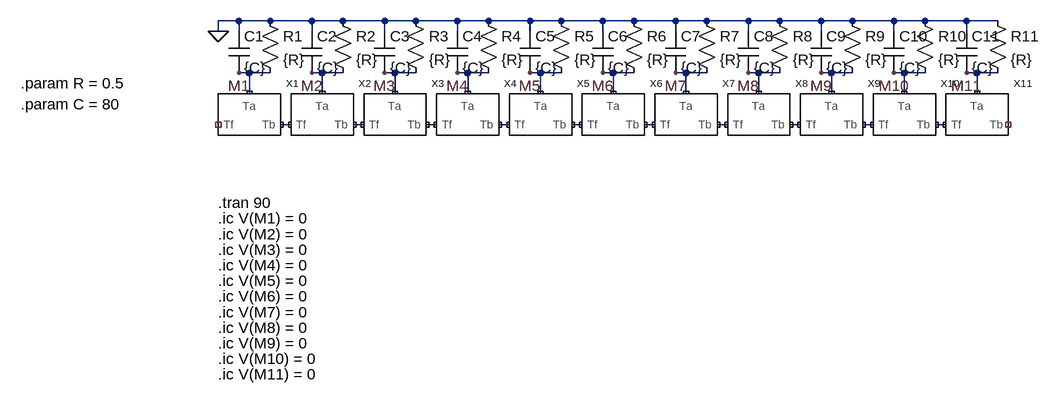
[diagram p0: schematic 22 Cell Stack.asc]
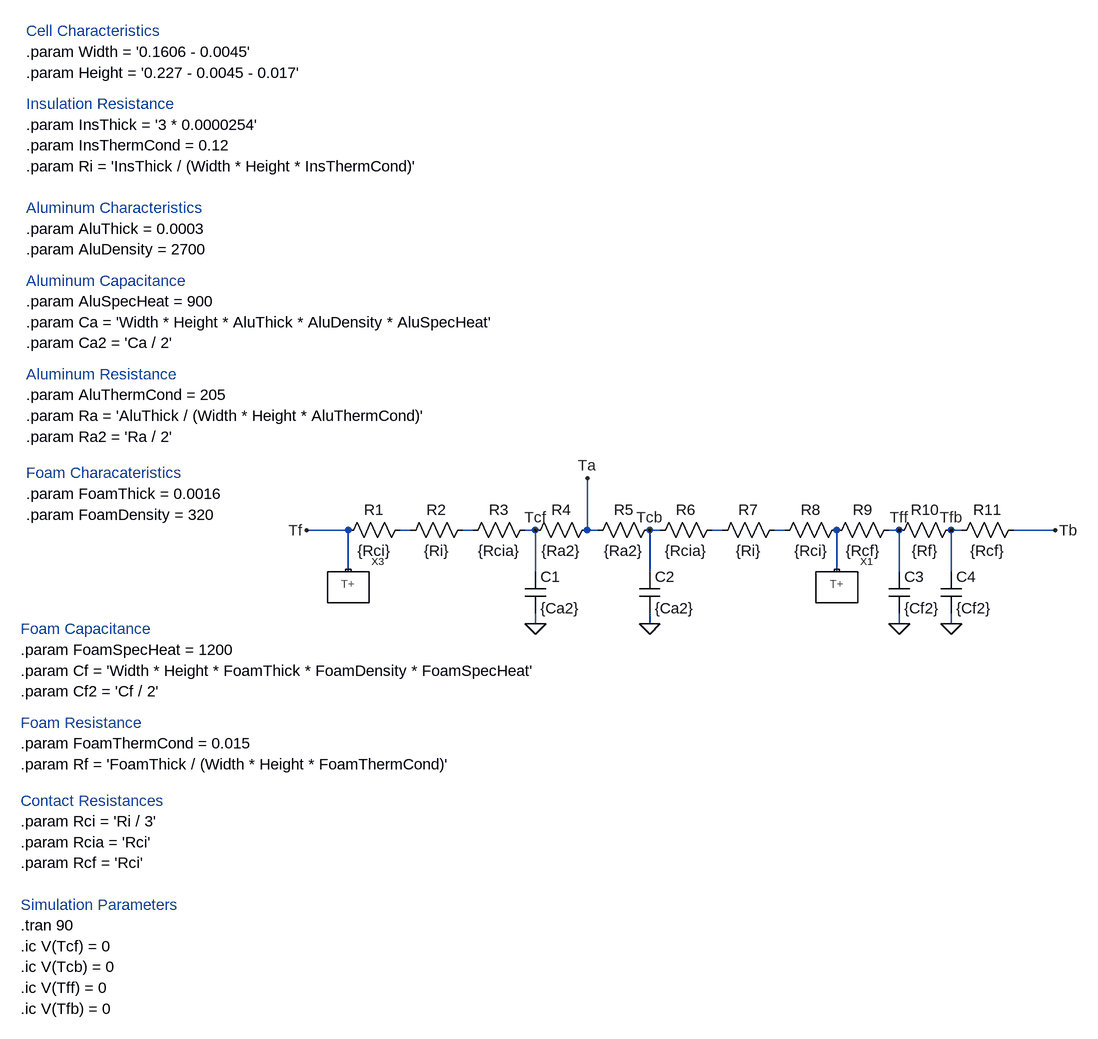
[diagram p1: sub-circuit module.asc]
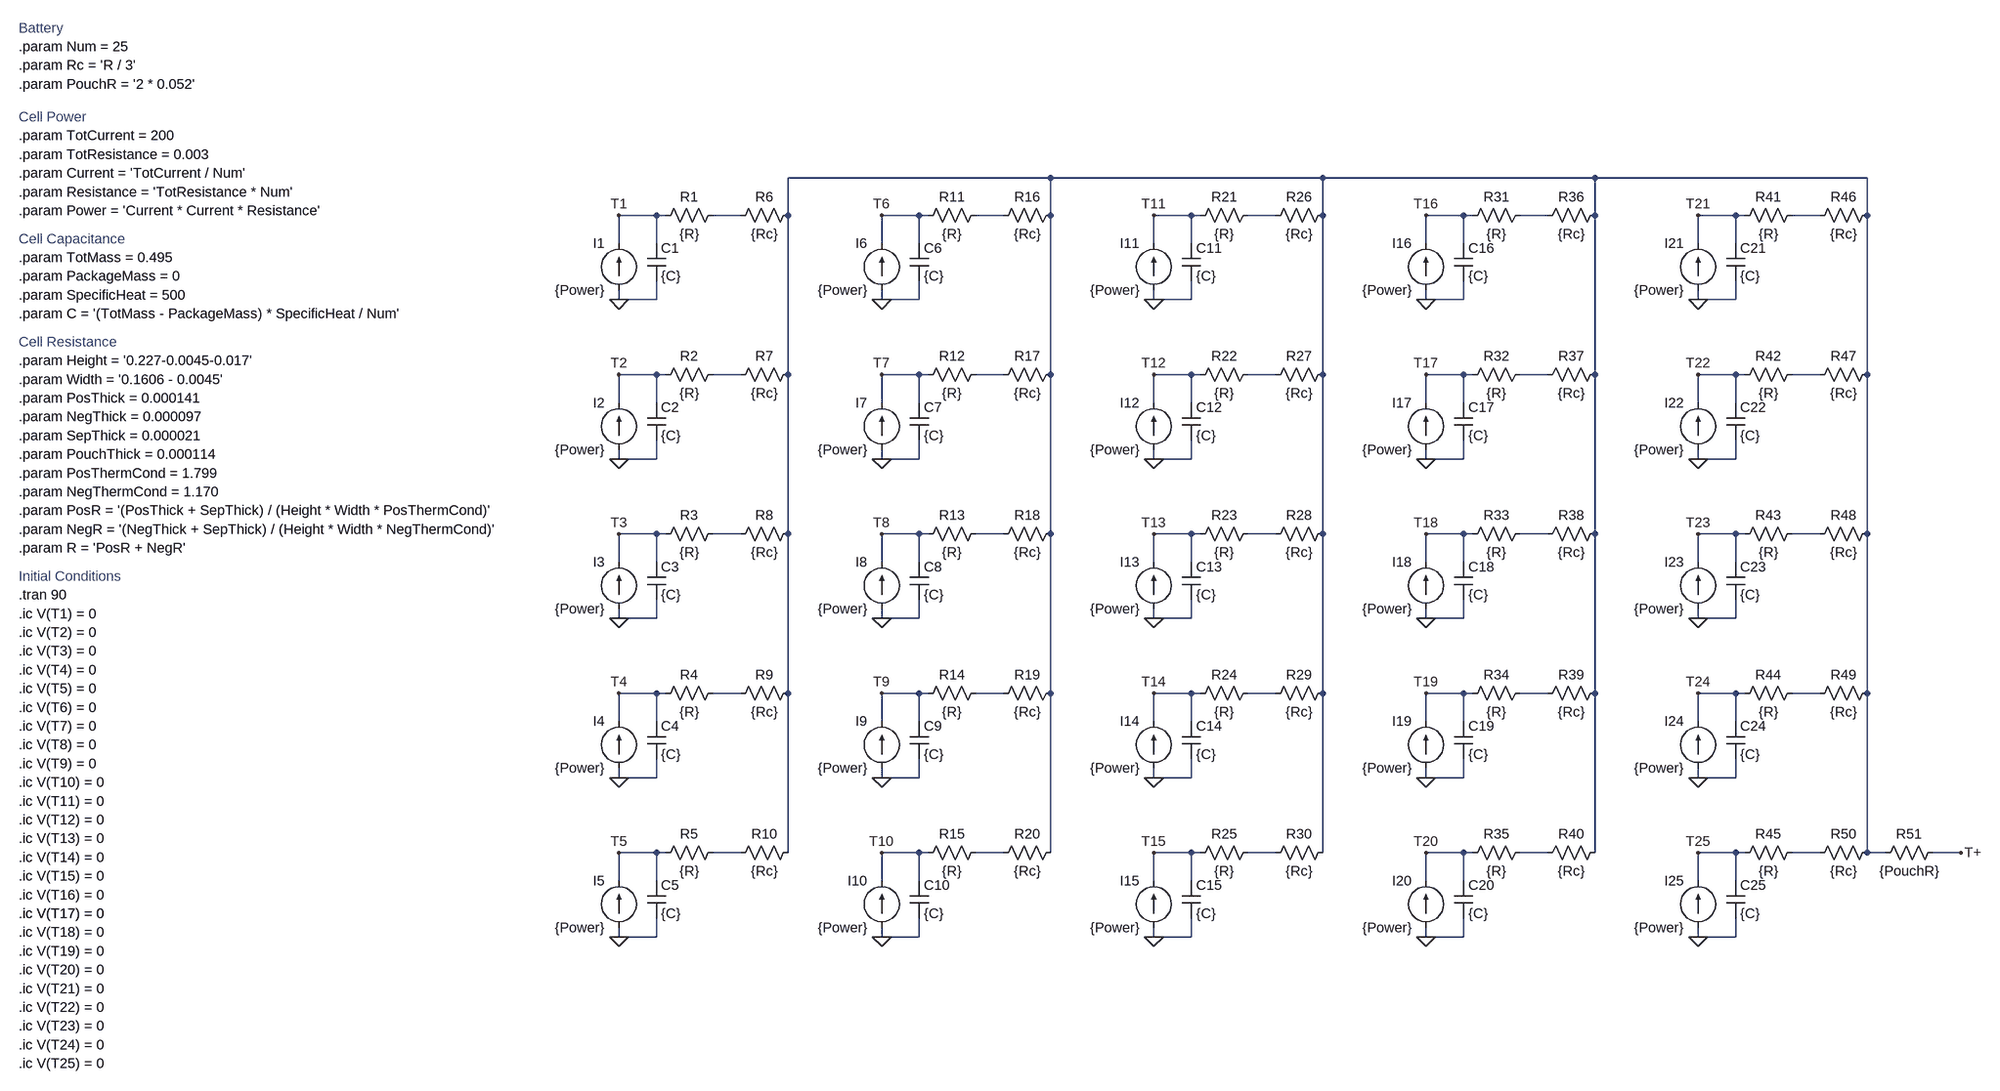
[diagram p2: sub-circuit cell.asc]
22 Cell Stack.asc, the LTspice schematic file:
Version 4
SHEET 1 880 680
WIRE -560 0 -592 0
WIRE -512 0 -560 0
WIRE -448 0 -512 0
WIRE -400 0 -448 0
WIRE -336 0 -400 0
WIRE -288 0 -336 0
WIRE -224 0 -288 0
WIRE -176 0 -224 0
WIRE -112 0 -176 0
WIRE -64 0 -112 0
WIRE 0 0 -64 0
WIRE 48 0 0 0
WIRE 112 0 48 0
WIRE 160 0 112 0
WIRE 224 0 160 0
WIRE 272 0 224 0
WIRE 336 0 272 0
WIRE 384 0 336 0
WIRE 448 0 384 0
WIRE 496 0 448 0
WIRE 560 0 496 0
WIRE 608 0 560 0
WIRE -592 16 -592 0
WIRE -560 16 -560 0
WIRE -448 16 -448 0
WIRE -336 16 -336 0
WIRE -224 16 -224 0
WIRE -112 16 -112 0
WIRE 0 16 0 0
WIRE 112 16 112 0
WIRE 224 16 224 0
WIRE 336 16 336 0
WIRE 448 16 448 0
WIRE 560 16 560 0
WIRE -544 80 -560 80
WIRE -512 80 -544 80
WIRE -432 80 -448 80
WIRE -400 80 -432 80
WIRE -320 80 -336 80
WIRE -288 80 -320 80
WIRE -208 80 -224 80
WIRE -176 80 -208 80
WIRE -96 80 -112 80
WIRE -64 80 -96 80
WIRE 16 80 0 80
WIRE 48 80 16 80
WIRE 128 80 112 80
WIRE 160 80 128 80
WIRE 240 80 224 80
WIRE 272 80 240 80
WIRE 352 80 336 80
WIRE 384 80 352 80
WIRE 464 80 448 80
WIRE 496 80 464 80
WIRE 576 80 560 80
WIRE 608 80 576 80
WIRE -544 112 -544 80
WIRE -432 112 -432 80
WIRE -320 112 -320 80
WIRE -208 112 -208 80
WIRE -96 112 -96 80
WIRE 16 112 16 80
WIRE 128 112 128 80
WIRE 240 112 240 80
WIRE 352 112 352 80
WIRE 464 112 464 80
WIRE 576 112 576 80
WIRE -480 160 -496 160
WIRE -368 160 -384 160
WIRE -256 160 -272 160
WIRE -144 160 -160 160
WIRE -32 160 -48 160
WIRE 80 160 64 160
WIRE 192 160 176 160
WIRE 304 160 288 160
WIRE 416 160 400 160
WIRE 528 160 512 160
FLAG -592 16 0
FLAG -560 80 M1
FLAG -448 80 M2
FLAG -336 80 M3
FLAG -224 80 M4
FLAG -112 80 M5
FLAG 0 80 M6
FLAG 112 80 M7
FLAG 224 80 M8
FLAG 336 80 M9
FLAG 448 80 M10
FLAG 560 80 M11
SYMBOL res -528 -16 R0
SYMATTR InstName R1
SYMATTR Value {R}
SYMBOL Module -544 160 R0
SYMATTR InstName X1
SYMBOL Module -432 160 R0
SYMATTR InstName X2
SYMBOL Module -320 160 R0
SYMATTR InstName X3
SYMBOL Module -208 160 R0
SYMATTR InstName X4
SYMBOL Module -96 160 R0
SYMATTR InstName X5
SYMBOL Module 16 160 R0
SYMATTR InstName X6
SYMBOL Module 128 160 R0
SYMATTR InstName X7
SYMBOL Module 240 160 R0
SYMATTR InstName X8
SYMBOL Module 352 160 R0
SYMATTR InstName X9
SYMBOL Module 464 160 R0
SYMATTR InstName X10
SYMBOL Module 576 160 R0
SYMATTR InstName X11
SYMBOL res -416 -16 R0
SYMATTR InstName R2
SYMATTR Value {R}
SYMBOL res -304 -16 R0
SYMATTR InstName R3
SYMATTR Value {R}
SYMBOL res -192 -16 R0
SYMATTR InstName R4
SYMATTR Value {R}
SYMBOL res -80 -16 R0
SYMATTR InstName R5
SYMATTR Value {R}
SYMBOL res 32 -16 R0
SYMATTR InstName R6
SYMATTR Value {R}
SYMBOL res 144 -16 R0
SYMATTR InstName R7
SYMATTR Value {R}
SYMBOL res 256 -16 R0
SYMATTR InstName R8
SYMATTR Value {R}
SYMBOL res 368 -16 R0
SYMATTR InstName R9
SYMATTR Value {R}
SYMBOL res 480 -16 R0
SYMATTR InstName R10
SYMATTR Value {R}
SYMBOL res 592 -16 R0
SYMATTR InstName R11
SYMATTR Value {R}
SYMBOL cap 544 16 R0
SYMATTR InstName C11
SYMATTR Value {C}
SYMBOL cap 432 16 R0
SYMATTR InstName C10
SYMATTR Value {C}
SYMBOL cap 320 16 R0
SYMATTR InstName C9
SYMATTR Value {C}
SYMBOL cap -576 16 R0
SYMATTR InstName C1
SYMATTR Value {C}
SYMBOL cap -464 16 R0
SYMATTR InstName C2
SYMATTR Value {C}
SYMBOL cap -352 16 R0
SYMATTR InstName C3
SYMATTR Value {C}
SYMBOL cap -240 16 R0
SYMATTR InstName C4
SYMATTR Value {C}
SYMBOL cap -128 16 R0
SYMATTR InstName C5
SYMATTR Value {C}
SYMBOL cap -16 16 R0
SYMATTR InstName C6
SYMATTR Value {C}
SYMBOL cap 96 16 R0
SYMATTR InstName C7
SYMATTR Value {C}
SYMBOL cap 208 16 R0
SYMATTR InstName C8
SYMATTR Value {C}
TEXT -592 280 Left 2 !.tran 90
TEXT -896 96 Left 2 !.param R = 0.5
TEXT -896 128 Left 2 !.param C = 80
TEXT -592 304 Left 2 !.ic V(M1) = 0
TEXT -592 328 Left 2 !.ic V(M2) = 0
TEXT -592 352 Left 2 !.ic V(M3) = 0
TEXT -592 376 Left 2 !.ic V(M4) = 0
TEXT -592 400 Left 2 !.ic V(M5) = 0
TEXT -592 424 Left 2 !.ic V(M6) = 0
TEXT -592 448 Left 2 !.ic V(M7) = 0
TEXT -592 472 Left 2 !.ic V(M8) = 0
TEXT -592 496 Left 2 !.ic V(M9) = 0
TEXT -592 520 Left 2 !.ic V(M10) = 0
TEXT -592 544 Left 2 !.ic V(M11) = 0

module.asc, the sub-circuit schematic file:
Version 4
SHEET 1 1396 928
WIRE 208 48 144 48
WIRE 304 48 288 48
WIRE 400 48 384 48
WIRE 496 48 480 48
WIRE 576 48 576 -32
WIRE 592 48 576 48
WIRE 688 48 672 48
WIRE 784 48 768 48
WIRE 880 48 864 48
WIRE 1056 48 1040 48
WIRE 1152 48 1136 48
WIRE 1296 48 1232 48
WIRE 208 112 208 48
WIRE 496 112 496 48
WIRE 672 112 672 48
WIRE 960 112 960 48
WIRE 1056 112 1056 48
WIRE 1136 112 1136 48
WIRE 496 192 496 176
WIRE 672 192 672 176
WIRE 1056 192 1056 176
WIRE 1136 192 1136 176
FLAG 496 192 0
FLAG 1056 192 0
FLAG 144 48 Tf
FLAG 1296 48 Tb
FLAG 576 -32 Ta
FLAG 672 192 0
FLAG 1136 192 0
FLAG 496 48 Tcf
FLAG 672 48 Tcb
FLAG 1056 48 Tff
FLAG 1136 48 Tfb
SYMBOL Cell 960 160 R0
SYMATTR InstName X1
SYMBOL Cell 208 160 R0
SYMATTR InstName X3
SYMBOL res 1152 32 R90
WINDOW 0 0 56 VBottom 2
WINDOW 3 32 56 VTop 2
SYMATTR InstName R10
SYMATTR Value {Rf}
SYMBOL res 400 32 R90
WINDOW 0 0 56 VBottom 2
WINDOW 3 32 56 VTop 2
SYMATTR InstName R2
SYMATTR Value {Ri}
SYMBOL res 592 32 R90
WINDOW 0 0 56 VBottom 2
WINDOW 3 32 56 VTop 2
SYMATTR InstName R4
SYMATTR Value {Ra2}
SYMBOL res 880 32 R90
WINDOW 0 0 56 VBottom 2
WINDOW 3 32 56 VTop 2
SYMATTR InstName R7
SYMATTR Value {Ri}
SYMBOL res 304 32 R90
WINDOW 0 0 56 VBottom 2
WINDOW 3 32 56 VTop 2
SYMATTR InstName R1
SYMATTR Value {Rci}
SYMBOL res 976 32 R90
WINDOW 0 0 56 VBottom 2
WINDOW 3 32 56 VTop 2
SYMATTR InstName R8
SYMATTR Value {Rci}
SYMBOL res 496 32 R90
WINDOW 0 0 56 VBottom 2
WINDOW 3 32 56 VTop 2
SYMATTR InstName R3
SYMATTR Value {Rcia}
SYMBOL res 784 32 R90
WINDOW 0 0 56 VBottom 2
WINDOW 3 32 56 VTop 2
SYMATTR InstName R6
SYMATTR Value {Rcia}
SYMBOL res 1056 32 R90
WINDOW 0 0 56 VBottom 2
WINDOW 3 32 56 VTop 2
SYMATTR InstName R9
SYMATTR Value {Rcf}
SYMBOL res 1248 32 R90
WINDOW 0 0 56 VBottom 2
WINDOW 3 32 56 VTop 2
SYMATTR InstName R11
SYMATTR Value {Rcf}
SYMBOL cap 480 112 R0
SYMATTR InstName C1
SYMATTR Value {Ca2}
SYMBOL cap 1040 112 R0
SYMATTR InstName C3
SYMATTR Value {Cf2}
SYMBOL cap 656 112 R0
SYMATTR InstName C2
SYMATTR Value {Ca2}
SYMBOL res 688 32 R90
WINDOW 0 0 56 VBottom 2
WINDOW 3 32 56 VTop 2
SYMATTR InstName R5
SYMATTR Value {Ra2}
SYMBOL cap 1120 112 R0
SYMATTR InstName C4
SYMATTR Value {Cf2}
TEXT -296 656 Left 2 !.tran 90
TEXT -288 -720 Left 2 ;Cell Characteristics
TEXT -288 -688 Left 2 !.param Width = '0.1606 - 0.0045'
TEXT -288 -656 Left 2 !.param Height = '0.227 - 0.0045 - 0.017'
TEXT -288 -608 Left 2 ;Insulation Resistance
TEXT -288 -576 Left 2 !.param InsThick = '3 * 0.0000254'
TEXT -288 -544 Left 2 !.param InsThermCond = 0.12
TEXT -296 496 Left 2 !.param Rci = 'Ri / 3'
TEXT -288 -448 Left 2 ;Aluminum Characteristics
TEXT -288 -416 Left 2 !.param AluThick = 0.0003
TEXT -288 -384 Left 2 !.param AluDensity = 2700
TEXT -288 -336 Left 2 ;Aluminum Capacitance
TEXT -288 -304 Left 2 !.param AluSpecHeat = 900
TEXT -288 -272 Left 2 !.param Ca = 'Width * Height * AluThick * AluDensity * AluSpecHeat'
TEXT -288 -240 Left 2 !.param Ca2 = 'Ca / 2'
TEXT -288 -192 Left 2 ;Aluminum Resistance
TEXT -288 -160 Left 2 !.param AluThermCond = 205
TEXT -288 -128 Left 2 !.param Ra = 'AluThick / (Width * Height * AluThermCond)'
TEXT -288 -96 Left 2 !.param Ra2 = 'Ra / 2'
TEXT -296 528 Left 2 !.param Rcia = 'Rci'
TEXT -288 -40 Left 2 ;Foam Characateristics
TEXT -288 -8 Left 2 !.param FoamThick = 0.0016
TEXT -288 24 Left 2 !.param FoamDensity = 320
TEXT -296 200 Left 2 ;Foam Capacitance
TEXT -296 232 Left 2 !.param FoamSpecHeat = 1200
TEXT -296 264 Left 2 !.param Cf = 'Width * Height * FoamThick * FoamDensity * FoamSpecHeat'
TEXT -296 296 Left 2 !.param Cf2 = 'Cf / 2'
TEXT -296 344 Left 2 ;Foam Resistance
TEXT -296 376 Left 2 !.param FoamThermCond = 0.015
TEXT -296 408 Left 2 !.param Rf = 'FoamThick / (Width * Height * FoamThermCond)'
TEXT -296 560 Left 2 !.param Rcf = 'Rci'
TEXT -288 -512 Left 2 !.param Ri = 'InsThick / (Width * Height * InsThermCond)'
TEXT -296 688 Left 2 !.ic V(Tcf) = 0
TEXT -296 720 Left 2 !.ic V(Tcb) = 0
TEXT -296 752 Left 2 !.ic V(Tff) = 0
TEXT -296 784 Left 2 !.ic V(Tfb) = 0
TEXT -296 624 Left 2 ;Simulation Parameters
TEXT -296 464 Left 2 ;Contact Resistances

cell.asc, the sub-circuit schematic file:
Version 4
SHEET 1 880 680
WIRE -6528 -8784 -6976 -8784
WIRE -6064 -8784 -6528 -8784
WIRE -5600 -8784 -6064 -8784
WIRE -5136 -8784 -5600 -8784
WIRE -7200 -8720 -7264 -8720
WIRE -7184 -8720 -7200 -8720
WIRE -7056 -8720 -7104 -8720
WIRE -6976 -8720 -6976 -8784
WIRE -6752 -8720 -6816 -8720
WIRE -6736 -8720 -6752 -8720
WIRE -6608 -8720 -6656 -8720
WIRE -6528 -8720 -6528 -8784
WIRE -6288 -8720 -6352 -8720
WIRE -6272 -8720 -6288 -8720
WIRE -6144 -8720 -6192 -8720
WIRE -6064 -8720 -6064 -8784
WIRE -5824 -8720 -5888 -8720
WIRE -5808 -8720 -5824 -8720
WIRE -5680 -8720 -5728 -8720
WIRE -5600 -8720 -5600 -8784
WIRE -5360 -8720 -5424 -8720
WIRE -5344 -8720 -5360 -8720
WIRE -5216 -8720 -5264 -8720
WIRE -5136 -8720 -5136 -8784
WIRE -7264 -8672 -7264 -8720
WIRE -7200 -8672 -7200 -8720
WIRE -6816 -8672 -6816 -8720
WIRE -6752 -8672 -6752 -8720
WIRE -6352 -8672 -6352 -8720
WIRE -6288 -8672 -6288 -8720
WIRE -5888 -8672 -5888 -8720
WIRE -5824 -8672 -5824 -8720
WIRE -5424 -8672 -5424 -8720
WIRE -5360 -8672 -5360 -8720
WIRE -7264 -8576 -7264 -8592
WIRE -7200 -8576 -7200 -8608
WIRE -7200 -8576 -7264 -8576
WIRE -6816 -8576 -6816 -8592
WIRE -6752 -8576 -6752 -8608
WIRE -6752 -8576 -6816 -8576
WIRE -6352 -8576 -6352 -8592
WIRE -6288 -8576 -6288 -8608
WIRE -6288 -8576 -6352 -8576
WIRE -5888 -8576 -5888 -8592
WIRE -5824 -8576 -5824 -8608
WIRE -5824 -8576 -5888 -8576
WIRE -5424 -8576 -5424 -8592
WIRE -5360 -8576 -5360 -8608
WIRE -5360 -8576 -5424 -8576
WIRE -7200 -8448 -7264 -8448
WIRE -7184 -8448 -7200 -8448
WIRE -7056 -8448 -7104 -8448
WIRE -6976 -8448 -6976 -8720
WIRE -6752 -8448 -6816 -8448
WIRE -6736 -8448 -6752 -8448
WIRE -6608 -8448 -6656 -8448
WIRE -6528 -8448 -6528 -8720
WIRE -6288 -8448 -6352 -8448
WIRE -6272 -8448 -6288 -8448
WIRE -6144 -8448 -6192 -8448
WIRE -6064 -8448 -6064 -8720
WIRE -5824 -8448 -5888 -8448
WIRE -5808 -8448 -5824 -8448
WIRE -5680 -8448 -5728 -8448
WIRE -5600 -8448 -5600 -8720
WIRE -5360 -8448 -5424 -8448
WIRE -5344 -8448 -5360 -8448
WIRE -5216 -8448 -5264 -8448
WIRE -5136 -8448 -5136 -8720
WIRE -7264 -8400 -7264 -8448
WIRE -7200 -8400 -7200 -8448
WIRE -6816 -8400 -6816 -8448
WIRE -6752 -8400 -6752 -8448
WIRE -6352 -8400 -6352 -8448
WIRE -6288 -8400 -6288 -8448
WIRE -5888 -8400 -5888 -8448
WIRE -5824 -8400 -5824 -8448
WIRE -5424 -8400 -5424 -8448
WIRE -5360 -8400 -5360 -8448
WIRE -7264 -8304 -7264 -8320
WIRE -7200 -8304 -7200 -8336
WIRE -7200 -8304 -7264 -8304
WIRE -6816 -8304 -6816 -8320
WIRE -6752 -8304 -6752 -8336
WIRE -6752 -8304 -6816 -8304
WIRE -6352 -8304 -6352 -8320
WIRE -6288 -8304 -6288 -8336
WIRE -6288 -8304 -6352 -8304
WIRE -5888 -8304 -5888 -8320
WIRE -5824 -8304 -5824 -8336
WIRE -5824 -8304 -5888 -8304
WIRE -5424 -8304 -5424 -8320
WIRE -5360 -8304 -5360 -8336
WIRE -5360 -8304 -5424 -8304
WIRE -7200 -8176 -7264 -8176
WIRE -7184 -8176 -7200 -8176
WIRE -7056 -8176 -7104 -8176
WIRE -6976 -8176 -6976 -8448
WIRE -6752 -8176 -6816 -8176
WIRE -6736 -8176 -6752 -8176
WIRE -6608 -8176 -6656 -8176
WIRE -6528 -8176 -6528 -8448
WIRE -6288 -8176 -6352 -8176
WIRE -6272 -8176 -6288 -8176
WIRE -6144 -8176 -6192 -8176
WIRE -6064 -8176 -6064 -8448
WIRE -5824 -8176 -5888 -8176
WIRE -5808 -8176 -5824 -8176
WIRE -5680 -8176 -5728 -8176
WIRE -5600 -8176 -5600 -8448
WIRE -5360 -8176 -5424 -8176
WIRE -5344 -8176 -5360 -8176
WIRE -5216 -8176 -5264 -8176
WIRE -5136 -8176 -5136 -8448
WIRE -7264 -8128 -7264 -8176
WIRE -7200 -8128 -7200 -8176
WIRE -6816 -8128 -6816 -8176
WIRE -6752 -8128 -6752 -8176
WIRE -6352 -8128 -6352 -8176
WIRE -6288 -8128 -6288 -8176
WIRE -5888 -8128 -5888 -8176
WIRE -5824 -8128 -5824 -8176
WIRE -5424 -8128 -5424 -8176
WIRE -5360 -8128 -5360 -8176
WIRE -7264 -8032 -7264 -8048
WIRE -7200 -8032 -7200 -8064
WIRE -7200 -8032 -7264 -8032
WIRE -6816 -8032 -6816 -8048
WIRE -6752 -8032 -6752 -8064
WIRE -6752 -8032 -6816 -8032
WIRE -6352 -8032 -6352 -8048
WIRE -6288 -8032 -6288 -8064
WIRE -6288 -8032 -6352 -8032
WIRE -5888 -8032 -5888 -8048
WIRE -5824 -8032 -5824 -8064
WIRE -5824 -8032 -5888 -8032
WIRE -5424 -8032 -5424 -8048
WIRE -5360 -8032 -5360 -8064
WIRE -5360 -8032 -5424 -8032
WIRE -7200 -7904 -7264 -7904
WIRE -7184 -7904 -7200 -7904
WIRE -7056 -7904 -7104 -7904
WIRE -6976 -7904 -6976 -8176
WIRE -6752 -7904 -6816 -7904
WIRE -6736 -7904 -6752 -7904
WIRE -6608 -7904 -6656 -7904
WIRE -6528 -7904 -6528 -8176
WIRE -6288 -7904 -6352 -7904
WIRE -6272 -7904 -6288 -7904
WIRE -6144 -7904 -6192 -7904
WIRE -6064 -7904 -6064 -8176
WIRE -5824 -7904 -5888 -7904
WIRE -5808 -7904 -5824 -7904
WIRE -5680 -7904 -5728 -7904
WIRE -5600 -7904 -5600 -8176
WIRE -5360 -7904 -5424 -7904
WIRE -5344 -7904 -5360 -7904
WIRE -5216 -7904 -5264 -7904
WIRE -5136 -7904 -5136 -8176
WIRE -7264 -7856 -7264 -7904
WIRE -7200 -7856 -7200 -7904
WIRE -6816 -7856 -6816 -7904
WIRE -6752 -7856 -6752 -7904
WIRE -6352 -7856 -6352 -7904
WIRE -6288 -7856 -6288 -7904
WIRE -5888 -7856 -5888 -7904
WIRE -5824 -7856 -5824 -7904
WIRE -5424 -7856 -5424 -7904
WIRE -5360 -7856 -5360 -7904
WIRE -7264 -7760 -7264 -7776
WIRE -7200 -7760 -7200 -7792
WIRE -7200 -7760 -7264 -7760
WIRE -6816 -7760 -6816 -7776
WIRE -6752 -7760 -6752 -7792
WIRE -6752 -7760 -6816 -7760
WIRE -6352 -7760 -6352 -7776
WIRE -6288 -7760 -6288 -7792
WIRE -6288 -7760 -6352 -7760
WIRE -5888 -7760 -5888 -7776
WIRE -5824 -7760 -5824 -7792
WIRE -5824 -7760 -5888 -7760
WIRE -5424 -7760 -5424 -7776
WIRE -5360 -7760 -5360 -7792
WIRE -5360 -7760 -5424 -7760
WIRE -7200 -7632 -7264 -7632
WIRE -7184 -7632 -7200 -7632
WIRE -7056 -7632 -7104 -7632
WIRE -6976 -7632 -6976 -7904
WIRE -6752 -7632 -6816 -7632
WIRE -6736 -7632 -6752 -7632
WIRE -6608 -7632 -6656 -7632
WIRE -6528 -7632 -6528 -7904
WIRE -6288 -7632 -6352 -7632
WIRE -6272 -7632 -6288 -7632
WIRE -6144 -7632 -6192 -7632
WIRE -6064 -7632 -6064 -7904
WIRE -5824 -7632 -5888 -7632
WIRE -5808 -7632 -5824 -7632
WIRE -5680 -7632 -5728 -7632
WIRE -5600 -7632 -5600 -7904
WIRE -5360 -7632 -5424 -7632
WIRE -5344 -7632 -5360 -7632
WIRE -5216 -7632 -5264 -7632
WIRE -5136 -7632 -5136 -7904
WIRE -5104 -7632 -5136 -7632
WIRE -4976 -7632 -5024 -7632
WIRE -7264 -7584 -7264 -7632
WIRE -7200 -7584 -7200 -7632
WIRE -6816 -7584 -6816 -7632
WIRE -6752 -7584 -6752 -7632
WIRE -6352 -7584 -6352 -7632
WIRE -6288 -7584 -6288 -7632
WIRE -5888 -7584 -5888 -7632
WIRE -5824 -7584 -5824 -7632
WIRE -5424 -7584 -5424 -7632
WIRE -5360 -7584 -5360 -7632
WIRE -7264 -7488 -7264 -7504
WIRE -7200 -7488 -7200 -7520
WIRE -7200 -7488 -7264 -7488
WIRE -6816 -7488 -6816 -7504
WIRE -6752 -7488 -6752 -7520
WIRE -6752 -7488 -6816 -7488
WIRE -6352 -7488 -6352 -7504
WIRE -6288 -7488 -6288 -7520
WIRE -6288 -7488 -6352 -7488
WIRE -5888 -7488 -5888 -7504
WIRE -5824 -7488 -5824 -7520
WIRE -5824 -7488 -5888 -7488
WIRE -5424 -7488 -5424 -7504
WIRE -5360 -7488 -5360 -7520
WIRE -5360 -7488 -5424 -7488
FLAG -7264 -8720 T1
FLAG -7264 -8448 T2
FLAG -7264 -8176 T3
FLAG -7264 -7904 T4
FLAG -7264 -7632 T5
FLAG -6816 -8720 T6
FLAG -6816 -8448 T7
FLAG -6816 -8176 T8
FLAG -6816 -7904 T9
FLAG -6816 -7632 T10
FLAG -6352 -8720 T11
FLAG -6352 -8448 T12
FLAG -6352 -8176 T13
FLAG -6352 -7904 T14
FLAG -6352 -7632 T15
FLAG -5888 -8720 T16
FLAG -5888 -8448 T17
FLAG -5888 -8176 T18
FLAG -5888 -7904 T19
FLAG -5888 -7632 T20
FLAG -5424 -8720 T21
FLAG -5424 -8448 T22
FLAG -5424 -8176 T23
FLAG -5424 -7904 T24
FLAG -5424 -7632 T25
FLAG -4976 -7632 T+
FLAG -7264 -8576 0
FLAG -7264 -8304 0
FLAG -7264 -8032 0
FLAG -7264 -7760 0
FLAG -7264 -7488 0
FLAG -6816 -7488 0
FLAG -6816 -7760 0
FLAG -6816 -8032 0
FLAG -6816 -8304 0
FLAG -6816 -8576 0
FLAG -6352 -8576 0
FLAG -6352 -8304 0
FLAG -6352 -8032 0
FLAG -6352 -7760 0
FLAG -6352 -7488 0
FLAG -5888 -7488 0
FLAG -5888 -7760 0
FLAG -5888 -8032 0
FLAG -5888 -8304 0
FLAG -5888 -8576 0
FLAG -5424 -8576 0
FLAG -5424 -8304 0
FLAG -5424 -8032 0
FLAG -5424 -7760 0
FLAG -5424 -7488 0
SYMBOL current -7264 -8592 R180
WINDOW 0 24 80 Left 2
WINDOW 3 24 0 Left 2
WINDOW 123 0 0 Left 2
WINDOW 39 0 0 Left 2
SYMATTR InstName I1
SYMATTR Value {Power}
SYMBOL cap -7216 -8672 R0
SYMATTR InstName C1
SYMATTR Value {C}
SYMBOL res -7088 -8736 R90
WINDOW 0 0 56 VBottom 2
WINDOW 3 32 56 VTop 2
SYMATTR InstName R1
SYMATTR Value {R}
SYMBOL current -7264 -8320 R180
WINDOW 0 24 80 Left 2
WINDOW 3 24 0 Left 2
WINDOW 123 0 0 Left 2
WINDOW 39 0 0 Left 2
SYMATTR InstName I2
SYMATTR Value {Power}
SYMBOL cap -7216 -8400 R0
SYMATTR InstName C2
SYMATTR Value {C}
SYMBOL res -7088 -8464 R90
WINDOW 0 0 56 VBottom 2
WINDOW 3 32 56 VTop 2
SYMATTR InstName R2
SYMATTR Value {R}
SYMBOL current -7264 -8048 R180
WINDOW 0 24 80 Left 2
WINDOW 3 24 0 Left 2
WINDOW 123 0 0 Left 2
WINDOW 39 0 0 Left 2
SYMATTR InstName I3
SYMATTR Value {Power}
SYMBOL cap -7216 -8128 R0
SYMATTR InstName C3
SYMATTR Value {C}
SYMBOL res -7088 -8192 R90
WINDOW 0 0 56 VBottom 2
WINDOW 3 32 56 VTop 2
SYMATTR InstName R3
SYMATTR Value {R}
SYMBOL current -7264 -7776 R180
WINDOW 0 24 80 Left 2
WINDOW 3 24 0 Left 2
WINDOW 123 0 0 Left 2
WINDOW 39 0 0 Left 2
SYMATTR InstName I4
SYMATTR Value {Power}
SYMBOL cap -7216 -7856 R0
SYMATTR InstName C4
SYMATTR Value {C}
SYMBOL res -7088 -7920 R90
WINDOW 0 0 56 VBottom 2
WINDOW 3 32 56 VTop 2
SYMATTR InstName R4
SYMATTR Value {R}
SYMBOL current -7264 -7504 R180
WINDOW 0 24 80 Left 2
WINDOW 3 24 0 Left 2
WINDOW 123 0 0 Left 2
WINDOW 39 0 0 Left 2
SYMATTR InstName I5
SYMATTR Value {Power}
SYMBOL cap -7216 -7584 R0
SYMATTR InstName C5
SYMATTR Value {C}
SYMBOL res -7088 -7648 R90
WINDOW 0 0 56 VBottom 2
WINDOW 3 32 56 VTop 2
SYMATTR InstName R5
SYMATTR Value {R}
SYMBOL res -6960 -8736 R90
WINDOW 0 0 56 VBottom 2
WINDOW 3 32 56 VTop 2
SYMATTR InstName R6
SYMATTR Value {Rc}
SYMBOL res -6960 -8464 R90
WINDOW 0 0 56 VBottom 2
WINDOW 3 32 56 VTop 2
SYMATTR InstName R7
SYMATTR Value {Rc}
SYMBOL res -6960 -8192 R90
WINDOW 0 0 56 VBottom 2
WINDOW 3 32 56 VTop 2
SYMATTR InstName R8
SYMATTR Value {Rc}
SYMBOL res -6960 -7920 R90
WINDOW 0 0 56 VBottom 2
WINDOW 3 32 56 VTop 2
SYMATTR InstName R9
SYMATTR Value {Rc}
SYMBOL res -6960 -7648 R90
WINDOW 0 0 56 VBottom 2
WINDOW 3 32 56 VTop 2
SYMATTR InstName R10
SYMATTR Value {Rc}
SYMBOL current -6816 -8592 R180
WINDOW 0 24 80 Left 2
WINDOW 3 24 0 Left 2
WINDOW 123 0 0 Left 2
WINDOW 39 0 0 Left 2
SYMATTR InstName I6
SYMATTR Value {Power}
SYMBOL cap -6768 -8672 R0
SYMATTR InstName C6
SYMATTR Value {C}
SYMBOL res -6640 -8736 R90
WINDOW 0 0 56 VBottom 2
WINDOW 3 32 56 VTop 2
SYMATTR InstName R11
SYMATTR Value {R}
SYMBOL current -6816 -8320 R180
WINDOW 0 24 80 Left 2
WINDOW 3 24 0 Left 2
WINDOW 123 0 0 Left 2
WINDOW 39 0 0 Left 2
SYMATTR InstName I7
SYMATTR Value {Power}
SYMBOL cap -6768 -8400 R0
SYMATTR InstName C7
SYMATTR Value {C}
SYMBOL res -6640 -8464 R90
WINDOW 0 0 56 VBottom 2
WINDOW 3 32 56 VTop 2
SYMATTR InstName R12
SYMATTR Value {R}
SYMBOL current -6816 -8048 R180
WINDOW 0 24 80 Left 2
WINDOW 3 24 0 Left 2
WINDOW 123 0 0 Left 2
WINDOW 39 0 0 Left 2
SYMATTR InstName I8
SYMATTR Value {Power}
SYMBOL cap -6768 -8128 R0
SYMATTR InstName C8
SYMATTR Value {C}
SYMBOL res -6640 -8192 R90
WINDOW 0 0 56 VBottom 2
WINDOW 3 32 56 VTop 2
SYMATTR InstName R13
SYMATTR Value {R}
SYMBOL current -6816 -7776 R180
WINDOW 0 24 80 Left 2
WINDOW 3 24 0 Left 2
WINDOW 123 0 0 Left 2
WINDOW 39 0 0 Left 2
SYMATTR InstName I9
SYMATTR Value {Power}
SYMBOL cap -6768 -7856 R0
SYMATTR InstName C9
SYMATTR Value {C}
SYMBOL res -6640 -7920 R90
WINDOW 0 0 56 VBottom 2
WINDOW 3 32 56 VTop 2
SYMATTR InstName R14
SYMATTR Value {R}
SYMBOL current -6816 -7504 R180
WINDOW 0 24 80 Left 2
WINDOW 3 24 0 Left 2
WINDOW 123 0 0 Left 2
WINDOW 39 0 0 Left 2
SYMATTR InstName I10
SYMATTR Value {Power}
SYMBOL cap -6768 -7584 R0
SYMATTR InstName C10
SYMATTR Value {C}
SYMBOL res -6640 -7648 R90
WINDOW 0 0 56 VBottom 2
WINDOW 3 32 56 VTop 2
SYMATTR InstName R15
SYMATTR Value {R}
SYMBOL res -6512 -8736 R90
WINDOW 0 0 56 VBottom 2
WINDOW 3 32 56 VTop 2
SYMATTR InstName R16
SYMATTR Value {Rc}
SYMBOL res -6512 -8464 R90
WINDOW 0 0 56 VBottom 2
WINDOW 3 32 56 VTop 2
SYMATTR InstName R17
SYMATTR Value {Rc}
SYMBOL res -6512 -8192 R90
WINDOW 0 0 56 VBottom 2
WINDOW 3 32 56 VTop 2
SYMATTR InstName R18
SYMATTR Value {Rc}
SYMBOL res -6512 -7920 R90
WINDOW 0 0 56 VBottom 2
WINDOW 3 32 56 VTop 2
SYMATTR InstName R19
SYMATTR Value {Rc}
SYMBOL res -6512 -7648 R90
WINDOW 0 0 56 VBottom 2
WINDOW 3 32 56 VTop 2
SYMATTR InstName R20
SYMATTR Value {Rc}
SYMBOL current -6352 -8592 R180
WINDOW 0 24 80 Left 2
WINDOW 3 24 0 Left 2
WINDOW 123 0 0 Left 2
WINDOW 39 0 0 Left 2
SYMATTR InstName I11
SYMATTR Value {Power}
SYMBOL cap -6304 -8672 R0
SYMATTR InstName C11
SYMATTR Value {C}
SYMBOL res -6176 -8736 R90
WINDOW 0 0 56 VBottom 2
WINDOW 3 32 56 VTop 2
SYMATTR InstName R21
SYMATTR Value {R}
SYMBOL current -6352 -8320 R180
WINDOW 0 24 80 Left 2
WINDOW 3 24 0 Left 2
WINDOW 123 0 0 Left 2
WINDOW 39 0 0 Left 2
SYMATTR InstName I12
SYMATTR Value {Power}
SYMBOL cap -6304 -8400 R0
SYMATTR InstName C12
SYMATTR Value {C}
SYMBOL res -6176 -8464 R90
WINDOW 0 0 56 VBottom 2
WINDOW 3 32 56 VTop 2
SYMATTR InstName R22
SYMATTR Value {R}
SYMBOL current -6352 -8048 R180
WINDOW 0 24 80 Left 2
WINDOW 3 24 0 Left 2
WINDOW 123 0 0 Left 2
WINDOW 39 0 0 Left 2
SYMATTR InstName I13
SYMATTR Value {Power}
SYMBOL cap -6304 -8128 R0
SYMATTR InstName C13
SYMATTR Value {C}
SYMBOL res -6176 -8192 R90
WINDOW 0 0 56 VBottom 2
WINDOW 3 32 56 VTop 2
SYMATTR InstName R23
SYMATTR Value {R}
SYMBOL current -6352 -7776 R180
WINDOW 0 24 80 Left 2
WINDOW 3 24 0 Left 2
WINDOW 123 0 0 Left 2
WINDOW 39 0 0 Left 2
SYMATTR InstName I14
SYMATTR Value {Power}
SYMBOL cap -6304 -7856 R0
SYMATTR InstName C14
SYMATTR Value {C}
SYMBOL res -6176 -7920 R90
WINDOW 0 0 56 VBottom 2
WINDOW 3 32 56 VTop 2
SYMATTR InstName R24
SYMATTR Value {R}
SYMBOL current -6352 -7504 R180
WINDOW 0 24 80 Left 2
WINDOW 3 24 0 Left 2
WINDOW 123 0 0 Left 2
WINDOW 39 0 0 Left 2
SYMATTR InstName I15
SYMATTR Value {Power}
SYMBOL cap -6304 -7584 R0
SYMATTR InstName C15
SYMATTR Value {C}
SYMBOL res -6176 -7648 R90
WINDOW 0 0 56 VBottom 2
WINDOW 3 32 56 VTop 2
SYMATTR InstName R25
SYMATTR Value {R}
SYMBOL res -6048 -8736 R90
WINDOW 0 0 56 VBottom 2
WINDOW 3 32 56 VTop 2
SYMATTR InstName R26
SYMATTR Value {Rc}
SYMBOL res -6048 -8464 R90
WINDOW 0 0 56 VBottom 2
WINDOW 3 32 56 VTop 2
SYMATTR InstName R27
SYMATTR Value {Rc}
SYMBOL res -6048 -8192 R90
WINDOW 0 0 56 VBottom 2
WINDOW 3 32 56 VTop 2
SYMATTR InstName R28
SYMATTR Value {Rc}
SYMBOL res -6048 -7920 R90
WINDOW 0 0 56 VBottom 2
WINDOW 3 32 56 VTop 2
SYMATTR InstName R29
SYMATTR Value {Rc}
SYMBOL res -6048 -7648 R90
WINDOW 0 0 56 VBottom 2
WINDOW 3 32 56 VTop 2
SYMATTR InstName R30
SYMATTR Value {Rc}
SYMBOL current -5888 -8592 R180
WINDOW 0 24 80 Left 2
WINDOW 3 24 0 Left 2
WINDOW 123 0 0 Left 2
WINDOW 39 0 0 Left 2
SYMATTR InstName I16
SYMATTR Value {Power}
SYMBOL cap -5840 -8672 R0
SYMATTR InstName C16
SYMATTR Value {C}
SYMBOL res -5712 -8736 R90
WINDOW 0 0 56 VBottom 2
WINDOW 3 32 56 VTop 2
SYMATTR InstName R31
SYMATTR Value {R}
SYMBOL current -5888 -8320 R180
WINDOW 0 24 80 Left 2
WINDOW 3 24 0 Left 2
WINDOW 123 0 0 Left 2
WINDOW 39 0 0 Left 2
SYMATTR InstName I17
SYMATTR Value {Power}
SYMBOL cap -5840 -8400 R0
SYMATTR InstName C17
SYMATTR Value {C}
SYMBOL res -5712 -8464 R90
WINDOW 0 0 56 VBottom 2
WINDOW 3 32 56 VTop 2
SYMATTR InstName R32
SYMATTR Value {R}
SYMBOL current -5888 -8048 R180
WINDOW 0 24 80 Left 2
WINDOW 3 24 0 Left 2
WINDOW 123 0 0 Left 2
WINDOW 39 0 0 Left 2
SYMATTR InstName I18
SYMATTR Value {Power}
SYMBOL cap -5840 -8128 R0
SYMATTR InstName C18
SYMATTR Value {C}
SYMBOL res -5712 -8192 R90
WINDOW 0 0 56 VBottom 2
WINDOW 3 32 56 VTop 2
SYMATTR InstName R33
SYMATTR Value {R}
SYMBOL current -5888 -7776 R180
WINDOW 0 24 80 Left 2
WINDOW 3 24 0 Left 2
WINDOW 123 0 0 Left 2
WINDOW 39 0 0 Left 2
SYMATTR InstName I19
SYMATTR Value {Power}
SYMBOL cap -5840 -7856 R0
SYMATTR InstName C19
SYMATTR Value {C}
SYMBOL res -5712 -7920 R90
WINDOW 0 0 56 VBottom 2
WINDOW 3 32 56 VTop 2
SYMATTR InstName R34
SYMATTR Value {R}
SYMBOL current -5888 -7504 R180
WINDOW 0 24 80 Left 2
WINDOW 3 24 0 Left 2
WINDOW 123 0 0 Left 2
WINDOW 39 0 0 Left 2
SYMATTR InstName I20
SYMATTR Value {Power}
SYMBOL cap -5840 -7584 R0
SYMATTR InstName C20
SYMATTR Value {C}
SYMBOL res -5712 -7648 R90
WINDOW 0 0 56 VBottom 2
WINDOW 3 32 56 VTop 2
SYMATTR InstName R35
SYMATTR Value {R}
SYMBOL res -5584 -8736 R90
WINDOW 0 0 56 VBottom 2
WINDOW 3 32 56 VTop 2
SYMATTR InstName R36
SYMATTR Value {Rc}
SYMBOL res -5584 -8464 R90
WINDOW 0 0 56 VBottom 2
WINDOW 3 32 56 VTop 2
SYMATTR InstName R37
SYMATTR Value {Rc}
SYMBOL res -5584 -8192 R90
WINDOW 0 0 56 VBottom 2
WINDOW 3 32 56 VTop 2
SYMATTR InstName R38
SYMATTR Value {Rc}
SYMBOL res -5584 -7920 R90
WINDOW 0 0 56 VBottom 2
WINDOW 3 32 56 VTop 2
SYMATTR InstName R39
SYMATTR Value {Rc}
SYMBOL res -5584 -7648 R90
WINDOW 0 0 56 VBottom 2
WINDOW 3 32 56 VTop 2
SYMATTR InstName R40
SYMATTR Value {Rc}
SYMBOL current -5424 -8592 R180
WINDOW 0 24 80 Left 2
WINDOW 3 24 0 Left 2
WINDOW 123 0 0 Left 2
WINDOW 39 0 0 Left 2
SYMATTR InstName I21
SYMATTR Value {Power}
SYMBOL cap -5376 -8672 R0
SYMATTR InstName C21
SYMATTR Value {C}
SYMBOL res -5248 -8736 R90
WINDOW 0 0 56 VBottom 2
WINDOW 3 32 56 VTop 2
SYMATTR InstName R41
SYMATTR Value {R}
SYMBOL current -5424 -8320 R180
WINDOW 0 24 80 Left 2
WINDOW 3 24 0 Left 2
WINDOW 123 0 0 Left 2
WINDOW 39 0 0 Left 2
SYMATTR InstName I22
SYMATTR Value {Power}
SYMBOL cap -5376 -8400 R0
SYMATTR InstName C22
SYMATTR Value {C}
SYMBOL res -5248 -8464 R90
WINDOW 0 0 56 VBottom 2
WINDOW 3 32 56 VTop 2
SYMATTR InstName R42
SYMATTR Value {R}
SYMBOL current -5424 -8048 R180
WINDOW 0 24 80 Left 2
WINDOW 3 24 0 Left 2
WINDOW 123 0 0 Left 2
WINDOW 39 0 0 Left 2
SYMATTR InstName I23
SYMATTR Value {Power}
SYMBOL cap -5376 -8128 R0
SYMATTR InstName C23
SYMATTR Value {C}
SYMBOL res -5248 -8192 R90
WINDOW 0 0 56 VBottom 2
WINDOW 3 32 56 VTop 2
SYMATTR InstName R43
SYMATTR Value {R}
SYMBOL current -5424 -7776 R180
WINDOW 0 24 80 Left 2
WINDOW 3 24 0 Left 2
WINDOW 123 0 0 Left 2
WINDOW 39 0 0 Left 2
SYMATTR InstName I24
SYMATTR Value {Power}
SYMBOL cap -5376 -7856 R0
SYMATTR InstName C24
SYMATTR Value {C}
SYMBOL res -5248 -7920 R90
WINDOW 0 0 56 VBottom 2
WINDOW 3 32 56 VTop 2
SYMATTR InstName R44
SYMATTR Value {R}
SYMBOL current -5424 -7504 R180
WINDOW 0 24 80 Left 2
WINDOW 3 24 0 Left 2
WINDOW 123 0 0 Left 2
WINDOW 39 0 0 Left 2
SYMATTR InstName I25
SYMATTR Value {Power}
SYMBOL cap -5376 -7584 R0
SYMATTR InstName C25
SYMATTR Value {C}
SYMBOL res -5248 -7648 R90
WINDOW 0 0 56 VBottom 2
WINDOW 3 32 56 VTop 2
SYMATTR InstName R45
SYMATTR Value {R}
SYMBOL res -5120 -8736 R90
WINDOW 0 0 56 VBottom 2
WINDOW 3 32 56 VTop 2
SYMATTR InstName R46
SYMATTR Value {Rc}
SYMBOL res -5120 -8464 R90
WINDOW 0 0 56 VBottom 2
WINDOW 3 32 56 VTop 2
SYMATTR InstName R47
SYMATTR Value {Rc}
SYMBOL res -5120 -8192 R90
WINDOW 0 0 56 VBottom 2
WINDOW 3 32 56 VTop 2
SYMATTR InstName R48
SYMATTR Value {Rc}
SYMBOL res -5120 -7920 R90
WINDOW 0 0 56 VBottom 2
WINDOW 3 32 56 VTop 2
SYMATTR InstName R49
SYMATTR Value {Rc}
SYMBOL res -5120 -7648 R90
WINDOW 0 0 56 VBottom 2
WINDOW 3 32 56 VTop 2
SYMATTR InstName R50
SYMATTR Value {Rc}
SYMBOL res -5008 -7648 R90
WINDOW 0 0 56 VBottom 2
WINDOW 3 32 56 VTop 2
SYMATTR InstName R51
SYMATTR Value {PouchR}
TEXT -8344 -8856 Left 2 !.param TotCurrent = 200
TEXT -8344 -8824 Left 2 !.param TotResistance = 0.003
TEXT -8344 -9008 Left 2 !.param Num = 25
TEXT -8344 -8792 Left 2 !.param Current = 'TotCurrent / Num'
TEXT -8344 -8760 Left 2 !.param Resistance = 'TotResistance * Num'
TEXT -8344 -8728 Left 2 !.param Power = 'Current * Current * Resistance'
TEXT -8344 -8648 Left 2 !.param TotMass = 0.495
TEXT -8344 -8616 Left 2 !.param PackageMass = 0
TEXT -8344 -8584 Left 2 !.param SpecificHeat = 500
TEXT -8344 -8552 Left 2 !.param C = '(TotMass - PackageMass) * SpecificHeat / Num'
TEXT -8344 -8472 Left 2 !.param Height = '0.227-0.0045-0.017'
TEXT -8344 -8440 Left 2 !.param Width = '0.1606 - 0.0045'
TEXT -8344 -8408 Left 2 !.param PosThick = 0.000141
TEXT -8344 -8376 Left 2 !.param NegThick = 0.000097
TEXT -8344 -8344 Left 2 !.param SepThick = 0.000021
TEXT -8344 -8312 Left 2 !.param PouchThick = 0.000114
TEXT -8344 -8280 Left 2 !.param PosThermCond = 1.799
TEXT -8344 -8248 Left 2 !.param NegThermCond = 1.170
TEXT -8344 -8216 Left 2 !.param PosR = '(PosThick + SepThick) / (Height * Width * PosThermCond)'
TEXT -8344 -8184 Left 2 !.param NegR = '(NegThick + SepThick) / (Height * Width * NegThermCond)'
TEXT -8344 -8152 Left 2 !.param R = 'PosR + NegR'
TEXT -8344 -8072 Left 2 !.tran 90
TEXT -8344 -8040 Left 2 !.ic V(T1) = 0
TEXT -8344 -8008 Left 2 !.ic V(T2) = 0
TEXT -8344 -7976 Left 2 !.ic V(T3) = 0
TEXT -8344 -7944 Left 2 !.ic V(T4) = 0
TEXT -8344 -7912 Left 2 !.ic V(T5) = 0
TEXT -8344 -7880 Left 2 !.ic V(T6) = 0
TEXT -8344 -7848 Left 2 !.ic V(T7) = 0
TEXT -8344 -7816 Left 2 !.ic V(T8) = 0
TEXT -8344 -7784 Left 2 !.ic V(T9) = 0
TEXT -8344 -7752 Left 2 !.ic V(T10) = 0
TEXT -8344 -7720 Left 2 !.ic V(T11) = 0
TEXT -8344 -7688 Left 2 !.ic V(T12) = 0
TEXT -8344 -7656 Left 2 !.ic V(T13) = 0
TEXT -8344 -7624 Left 2 !.ic V(T14) = 0
TEXT -8344 -7592 Left 2 !.ic V(T15) = 0
TEXT -8344 -7560 Left 2 !.ic V(T16) = 0
TEXT -8344 -7528 Left 2 !.ic V(T17) = 0
TEXT -8344 -7496 Left 2 !.ic V(T18) = 0
TEXT -8344 -7464 Left 2 !.ic V(T19) = 0
TEXT -8344 -7528 Left 2 !.ic V(T17) = 0
TEXT -8344 -7432 Left 2 !.ic V(T20) = 0
TEXT -8344 -7400 Left 2 !.ic V(T21) = 0
TEXT -8344 -7368 Left 2 !.ic V(T22) = 0
TEXT -8344 -7336 Left 2 !.ic V(T23) = 0
TEXT -8344 -7272 Left 2 !.ic V(T25) = 0
TEXT -8344 -7304 Left 2 !.ic V(T24) = 0
TEXT -8344 -8976 Left 2 !.param Rc = 'R / 3'
TEXT -8344 -9040 Left 2 ;Battery
TEXT -8344 -8888 Left 2 ;Cell Power
TEXT -8344 -8680 Left 2 ;Cell Capacitance
TEXT -8344 -8504 Left 2 ;Cell Resistance
TEXT -8344 -8104 Left 2 ;Initial Conditions
TEXT -8344 -8944 Left 2 !.param PouchR = '2 * 0.052'

The netlist it stands for:
* 22 Cell Stack.asc
R1 0 M1 {R}
XX1 M1 NC_01 N001 module
XX2 M2 N001 N002 module
XX3 M3 N002 N003 module
XX4 M4 N003 N004 module
XX5 M5 N004 N005 module
XX6 M6 N005 N006 module
XX7 M7 N006 N007 module
XX8 M8 N007 N008 module
XX9 M9 N008 N009 module
XX10 M10 N009 N010 module
XX11 M11 N010 NC_02 module
R2 0 M2 {R}
R3 0 M3 {R}
R4 0 M4 {R}
R5 0 M5 {R}
R6 0 M6 {R}
R7 0 M7 {R}
R8 0 M8 {R}
R9 0 M9 {R}
R10 0 M10 {R}
R11 0 M11 {R}
C11 0 M11 {C}
C10 0 M10 {C}
C9 0 M9 {C}
C1 0 M1 {C}
C2 0 M2 {C}
C3 0 M3 {C}
C4 0 M4 {C}
C5 0 M5 {C}
C6 0 M6 {C}
C7 0 M7 {C}
C8 0 M8 {C}

* block symbol definitions
.subckt module Ta Tf Tb
XX1 N005 cell
XX3 Tf cell
R10 Tfb Tff {Rf}
R2 N002 N001 {Ri}
R4 Ta Tcf {Ra2}
R7 N004 N003 {Ri}
R1 N001 Tf {Rci}
R8 N005 N004 {Rci}
R3 Tcf N002 {Rcia}
R6 N003 Tcb {Rcia}
R9 Tff N005 {Rcf}
R11 Tb Tfb {Rcf}
C1 Tcf 0 {Ca2}
C3 Tff 0 {Cf2}
C2 Tcb 0 {Ca2}
R5 Tcb Ta {Ra2}
C4 Tfb 0 {Cf2}
.tran 90
* Cell Characteristics
.param Width = '0.1606 - 0.0045'
.param Height = '0.227 - 0.0045 - 0.017'
* Insulation Resistance
.param InsThick = '3 * 0.0000254'
.param InsThermCond = 0.12
.param Rci = 'Ri / 3'
* Aluminum Characteristics
.param AluThick = 0.0003
.param AluDensity = 2700
* Aluminum Capacitance
.param AluSpecHeat = 900
.param Ca = 'Width * Height * AluThick * AluDensity * AluSpecHeat'
.param Ca2 = 'Ca / 2'
* Aluminum Resistance
.param AluThermCond = 205
.param Ra = 'AluThick / (Width * Height * AluThermCond)'
.param Ra2 = 'Ra / 2'
.param Rcia = 'Rci'
* Foam Characateristics
.param FoamThick = 0.0016
.param FoamDensity = 320
* Foam Capacitance
.param FoamSpecHeat = 1200
.param Cf = 'Width * Height * FoamThick * FoamDensity * FoamSpecHeat'
.param Cf2 = 'Cf / 2'
* Foam Resistance
.param FoamThermCond = 0.015
.param Rf = 'FoamThick / (Width * Height * FoamThermCond)'
.param Rcf = 'Rci'
.param Ri = 'InsThick / (Width * Height * InsThermCond)'
.ic V(Tcf) = 0
.ic V(Tcb) = 0
.ic V(Tff) = 0
.ic V(Tfb) = 0
* Simulation Parameters
* Contact Resistances
.ends module

.subckt cell T+
I1 0 T1 {Power}
C1 T1 0 {C}
R1 N002 T1 {R}
I2 0 T2 {Power}
C2 T2 0 {C}
R2 N007 T2 {R}
I3 0 T3 {Power}
C3 T3 0 {C}
R3 N012 T3 {R}
I4 0 T4 {Power}
C4 T4 0 {C}
R4 N017 T4 {R}
I5 0 T5 {Power}
C5 T5 0 {C}
R5 N022 T5 {R}
R6 N001 N002 {Rc}
R7 N001 N007 {Rc}
R8 N001 N012 {Rc}
R9 N001 N017 {Rc}
R10 N001 N022 {Rc}
I6 0 T6 {Power}
C6 T6 0 {C}
R11 N003 T6 {R}
I7 0 T7 {Power}
C7 T7 0 {C}
R12 N008 T7 {R}
I8 0 T8 {Power}
C8 T8 0 {C}
R13 N013 T8 {R}
I9 0 T9 {Power}
C9 T9 0 {C}
R14 N018 T9 {R}
I10 0 T10 {Power}
C10 T10 0 {C}
R15 N023 T10 {R}
R16 N001 N003 {Rc}
R17 N001 N008 {Rc}
R18 N001 N013 {Rc}
R19 N001 N018 {Rc}
R20 N001 N023 {Rc}
I11 0 T11 {Power}
C11 T11 0 {C}
R21 N004 T11 {R}
I12 0 T12 {Power}
C12 T12 0 {C}
R22 N009 T12 {R}
I13 0 T13 {Power}
C13 T13 0 {C}
R23 N014 T13 {R}
I14 0 T14 {Power}
C14 T14 0 {C}
R24 N019 T14 {R}
I15 0 T15 {Power}
C15 T15 0 {C}
R25 N024 T15 {R}
R26 N001 N004 {Rc}
R27 N001 N009 {Rc}
R28 N001 N014 {Rc}
R29 N001 N019 {Rc}
R30 N001 N024 {Rc}
I16 0 T16 {Power}
C16 T16 0 {C}
R31 N005 T16 {R}
I17 0 T17 {Power}
C17 T17 0 {C}
R32 N010 T17 {R}
I18 0 T18 {Power}
C18 T18 0 {C}
R33 N015 T18 {R}
I19 0 T19 {Power}
C19 T19 0 {C}
R34 N020 T19 {R}
I20 0 T20 {Power}
C20 T20 0 {C}
R35 N025 T20 {R}
R36 N001 N005 {Rc}
R37 N001 N010 {Rc}
R38 N001 N015 {Rc}
R39 N001 N020 {Rc}
R40 N001 N025 {Rc}
I21 0 T21 {Power}
C21 T21 0 {C}
R41 N006 T21 {R}
I22 0 T22 {Power}
C22 T22 0 {C}
R42 N011 T22 {R}
I23 0 T23 {Power}
C23 T23 0 {C}
R43 N016 T23 {R}
I24 0 T24 {Power}
C24 T24 0 {C}
R44 N021 T24 {R}
I25 0 T25 {Power}
C25 T25 0 {C}
R45 N026 T25 {R}
R46 N001 N006 {Rc}
R47 N001 N011 {Rc}
R48 N001 N016 {Rc}
R49 N001 N021 {Rc}
R50 N001 N026 {Rc}
R51 T+ N001 {PouchR}
.param TotCurrent = 200
.param TotResistance = 0.003
.param Num = 25
.param Current = 'TotCurrent / Num'
.param Resistance = 'TotResistance * Num'
.param Power = 'Current * Current * Resistance'
.param TotMass = 0.495
.param PackageMass = 0
.param SpecificHeat = 500
.param C = '(TotMass - PackageMass) * SpecificHeat / Num'
.param Height = '0.227-0.0045-0.017'
.param Width = '0.1606 - 0.0045'
.param PosThick = 0.000141
.param NegThick = 0.000097
.param SepThick = 0.000021
.param PouchThick = 0.000114
.param PosThermCond = 1.799
.param NegThermCond = 1.170
.param PosR = '(PosThick + SepThick) / (Height * Width * PosThermCond)'
.param NegR = '(NegThick + SepThick) / (Height * Width * NegThermCond)'
.param R = 'PosR + NegR'
.tran 90
.ic V(T1) = 0
.ic V(T2) = 0
.ic V(T3) = 0
.ic V(T4) = 0
.ic V(T5) = 0
.ic V(T6) = 0
.ic V(T7) = 0
.ic V(T8) = 0
.ic V(T9) = 0
.ic V(T10) = 0
.ic V(T11) = 0
.ic V(T12) = 0
.ic V(T13) = 0
.ic V(T14) = 0
.ic V(T15) = 0
.ic V(T16) = 0
.ic V(T17) = 0
.ic V(T18) = 0
.ic V(T19) = 0
.ic V(T17) = 0
.ic V(T20) = 0
.ic V(T21) = 0
.ic V(T22) = 0
.ic V(T23) = 0
.ic V(T25) = 0
.ic V(T24) = 0
.param Rc = 'R / 3'
* Battery
* Cell Power
* Cell Capacitance
* Cell Resistance
* Initial Conditions
.param PouchR = '2 * 0.052'
.ends cell

.tran 90
.param R = 0.5
.param C = 80
.ic V(M1) = 0
.ic V(M2) = 0
.ic V(M3) = 0
.ic V(M4) = 0
.ic V(M5) = 0
.ic V(M6) = 0
.ic V(M7) = 0
.ic V(M8) = 0
.ic V(M9) = 0
.ic V(M10) = 0
.ic V(M11) = 0
.backanno
.end